# EAGLE design on_protoboard (EAGLE 7.7.0)
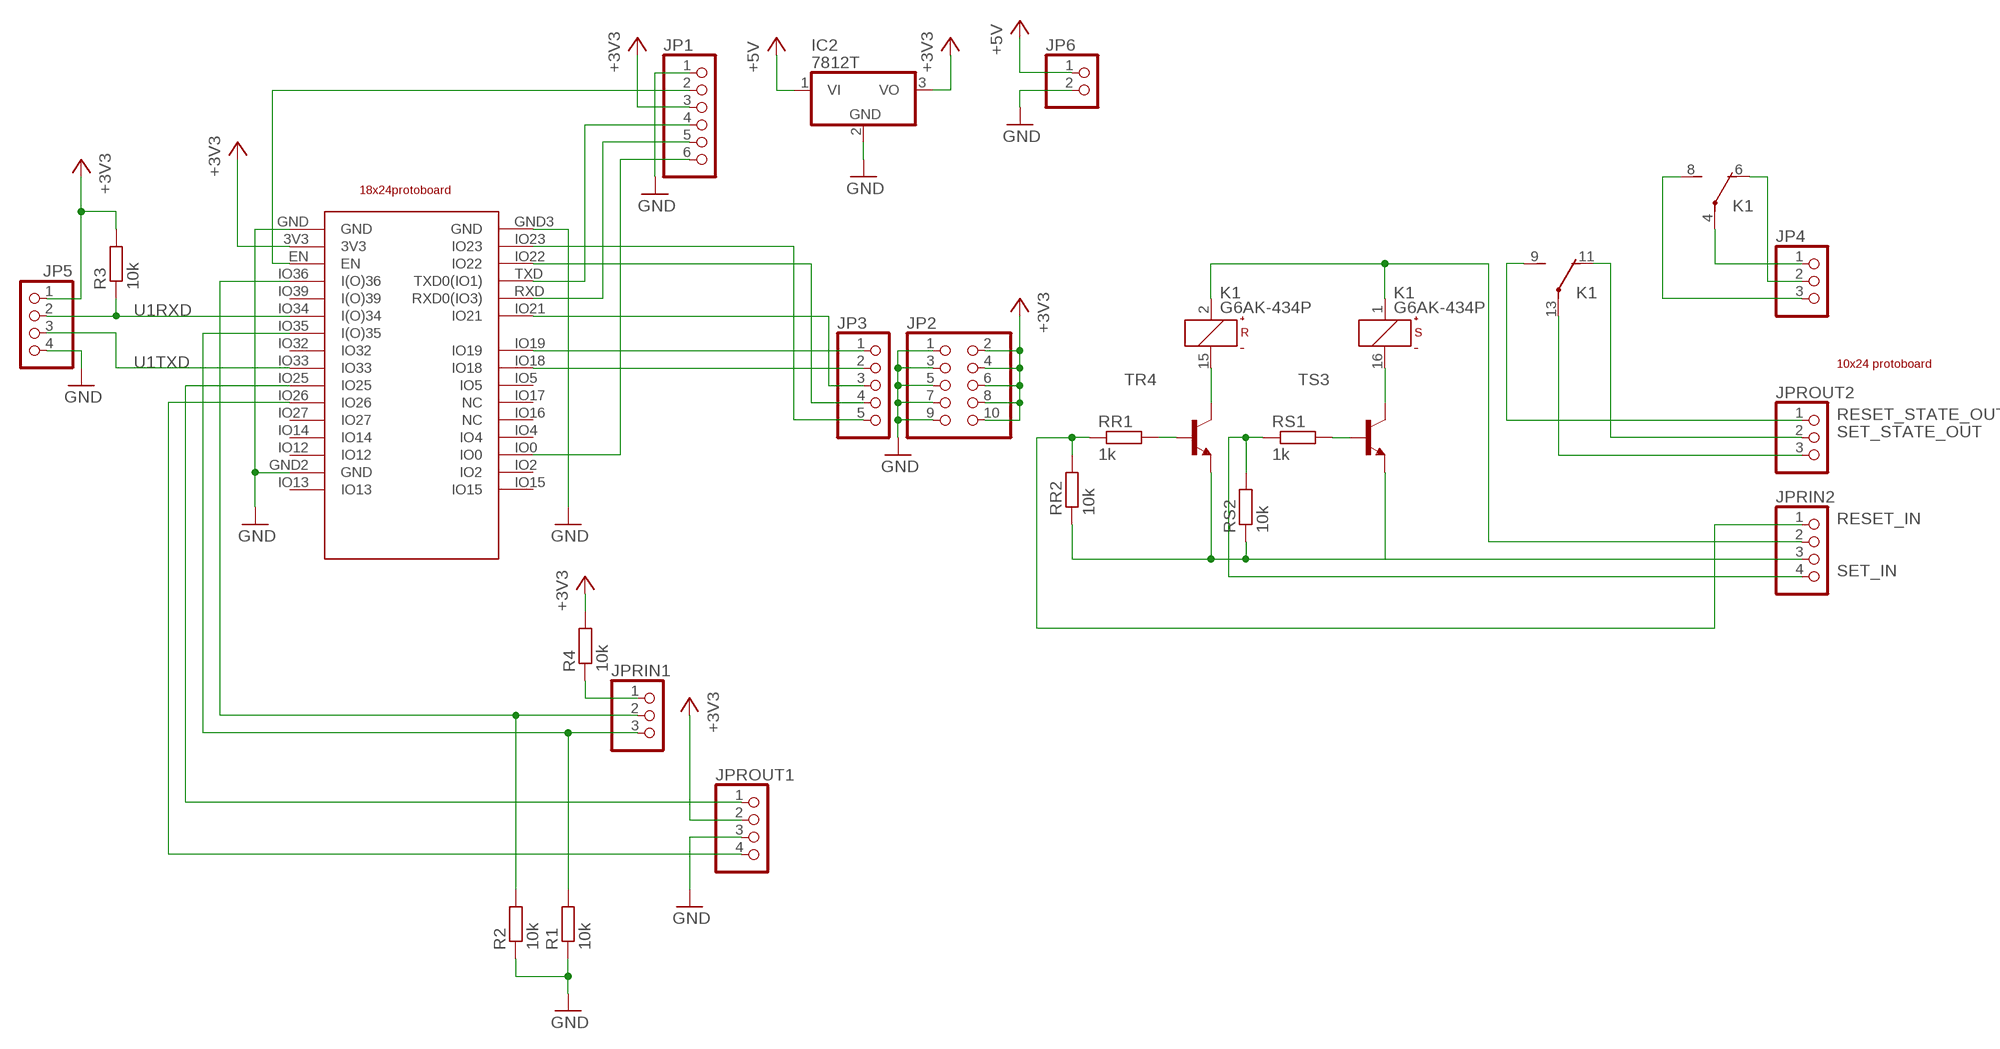
[diagram p0: schematic, sheet 1]

## Parts
ESP-32S-ADAPTER-PCB1  ESP-32S-ADAPTER-BREAKOUT  [ESP-32S-ADAPTER-PCB]
IC2  7812T  [TO220H]
JP1  PINHD-1X6/90  [1X06/90]
JP2  PINHD-2X5  [2X05]
JP3  PINHD-1X5  [1X05]
JP4  PINHD-1X3  [1X03]
JP5  PINHD-1X4  [1X04]
JP6  PINHD-1X2  [1X02]
JPRIN1  PINHD-1X3  [1X03]
JPRIN2  PINHD-1X4  [1X04]
JPROUT1  PINHD-1X4  [1X04]
JPROUT2  PINHD-1X3  [1X03]
K1  G6AK-434P  [G6AK-434P]
R1  10k  R-EU_R0603  [R0603]
R2  10k  R-EU_R0603  [R0603]
R3  10k  R-EU_R0603  [R0603]
R4  10k  R-EU_R0603  [R0603]
RR1  1k  R-EU_R0603  [R0603]
RR2  10k  R-EU_R0603  [R0603]
RS1  1k  R-EU_R0603  [R0603]
RS2  10k  R-EU_R0603  [R0603]
TR4  -NPN-TO92-EBC  [TO92-EBC]
TS3  -NPN-TO92-EBC  [TO92-EBC]
U$1  18X24  [PROTOBOARD_18X24_HOLE]
U$2  10X24  [PROTOBOARD_10X24_HOLE]

## Nets
+3V3: ESP-32S-ADAPTER-PCB1.3V3 IC2.3(VO) JP1.3 JP2.2 JP2.4 JP2.6 JP2.8 JP2.10 JP5.1 JPROUT1.2 R3.2 R4.2
+5V: IC2.1(VI) JP6.1
GND: ESP-32S-ADAPTER-PCB1.GND ESP-32S-ADAPTER-PCB1.GND2(GND) ESP-32S-ADAPTER-PCB1.GND3(GND) IC2.2(GND) JP1.1 JP2.1 JP2.3 JP2.5 JP2.7 JP2.9 JP5.4 JP6.2 JPROUT1.3 R1.1 R2.1
N$1: ESP-32S-ADAPTER-PCB1.EN JP1.2
N$2: JPRIN2.2 K1.1(-S:+) K1.2(-R:+)
N$3: ESP-32S-ADAPTER-PCB1.TXD(TXD0(IO1)) JP1.4
N$4: ESP-32S-ADAPTER-PCB1.RXD(RXD0(IO3)) JP1.5
N$5: K1.15(-R:-) TR4.C
N$6: ESP-32S-ADAPTER-PCB1.IO0 JP1.6
N$7: K1.16(-S:-) TS3.C
N$8: RS1.2 TS3.B
N$9: JPRIN2.3 RR2.1 RS2.1 TR4.E TS3.E
N$10: JPROUT2.3 K1.13(-2:P)
N$11: RR1.2 TR4.B
N$12: ESP-32S-ADAPTER-PCB1.IO19 JP3.1
N$13: ESP-32S-ADAPTER-PCB1.IO18 JP3.2
N$14: ESP-32S-ADAPTER-PCB1.IO21 JP3.3
N$15: JP4.1 K1.4(-1:P)
N$16: JP4.3 K1.8(-1:S)
N$17: ESP-32S-ADAPTER-PCB1.IO22 JP3.4
N$18: ESP-32S-ADAPTER-PCB1.IO35(I(O)35) JPRIN1.3 R1.2
N$19: JP4.2 K1.6(-1:O)
N$20: ESP-32S-ADAPTER-PCB1.IO36(I(O)36) JPRIN1.2 R2.2
N$21: ESP-32S-ADAPTER-PCB1.IO23 JP3.5
N$22: JPRIN1.1 R4.1
N$23: ESP-32S-ADAPTER-PCB1.IO25 JPROUT1.1
N$24: ESP-32S-ADAPTER-PCB1.IO26 JPROUT1.4
RESET_IN: JPRIN2.1 RR1.1 RR2.2
RESET_STATE_OUT: JPROUT2.1 K1.9(-2:S)
SET_IN: JPRIN2.4 RS1.1 RS2.2
SET_STATE_OUT: JPROUT2.2 K1.11(-2:O)
U1RXD: ESP-32S-ADAPTER-PCB1.IO34(I(O)34) JP5.2 R3.1
U1TXD: ESP-32S-ADAPTER-PCB1.IO33 JP5.3
Unconnected: ESP-32S-ADAPTER-PCB1.IO2 ESP-32S-ADAPTER-PCB1.IO4 ESP-32S-ADAPTER-PCB1.IO5 ESP-32S-ADAPTER-PCB1.IO12 ESP-32S-ADAPTER-PCB1.IO13 ESP-32S-ADAPTER-PCB1.IO14 ESP-32S-ADAPTER-PCB1.IO15 ESP-32S-ADAPTER-PCB1.IO16(NC) ESP-32S-ADAPTER-PCB1.IO17(NC) ESP-32S-ADAPTER-PCB1.IO27 ESP-32S-ADAPTER-PCB1.IO32 ESP-32S-ADAPTER-PCB1.IO39(I(O)39) K1.3(-4:P) K1.5(-4:O) K1.7(-4:S) K1.10(-3:S) K1.12(-3:O) K1.14(-3:P)

## Library data of the parts
ESP-32S-ADAPTER-PCB1 = ESP-32s-adapter-breakout:ESP-32S-ADAPTER-BREAKOUT
IC2 = linear:78*: Positive VOLTAGE REGULATOR Source: http://cache.national.com/ds/LM/LM78L05.pdf http://www.fairchildsemi.com/ds/LM/LM7805.pdf
JP1 = pinhead:PINHD-1X6: PIN HEADER
JP2 = pinhead:PINHD-2X5: PIN HEADER
JP3 = pinhead:PINHD-1X5: PIN HEADER
JP4 JPRIN1 JPROUT2 = pinhead:PINHD-1X3: PIN HEADER
JP5 JPRIN2 JPROUT1 = pinhead:PINHD-1X4: PIN HEADER
JP6 = pinhead:PINHD-1X2: PIN HEADER
K1 = relay:G6AK-434P: RELAY 4 x switch, dual coil latching, 0.3 A/125 V AC, 1 A/30 V DC, Omron; OC_FARNELL: unknown; OC_NEWARK: unknown
R1-R4 RR1 RR2 RS1 RS2 = rcl:R-EU_: RESISTOR, European symbol
TR4 TS3 = transistor:*-NPN-: NPN Transistror BF959 corrected 2008.03.06
U$1 = Protoboards:18X24
U$2 = Protoboards:10X24

## Board
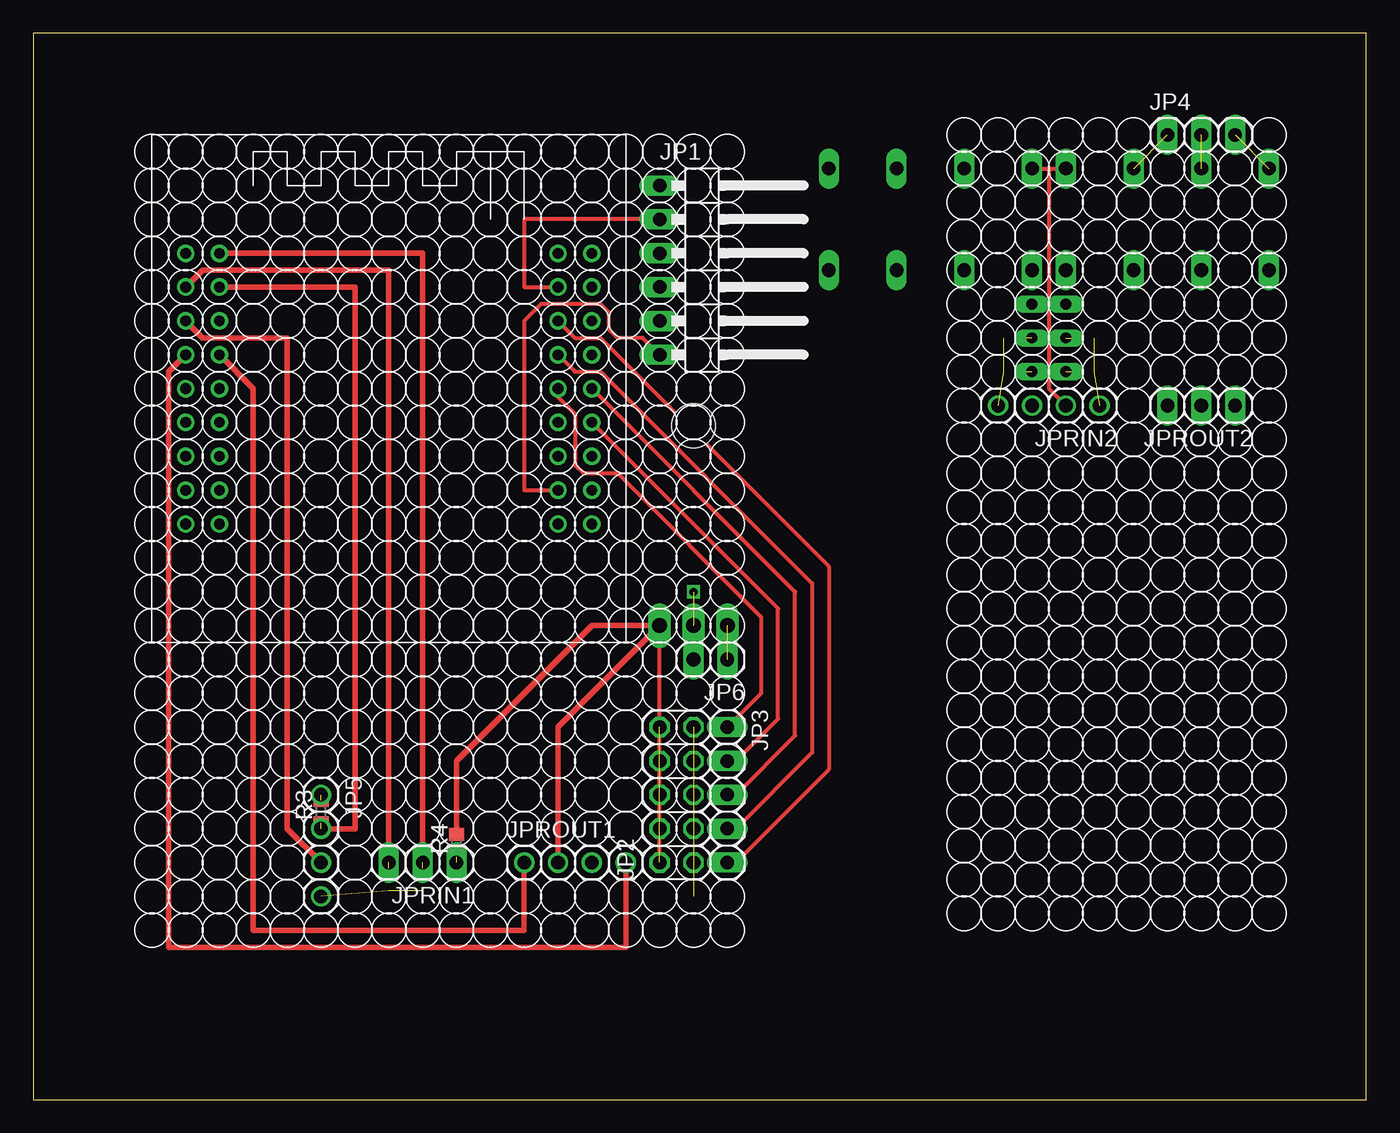
[diagram p1: board, top side]
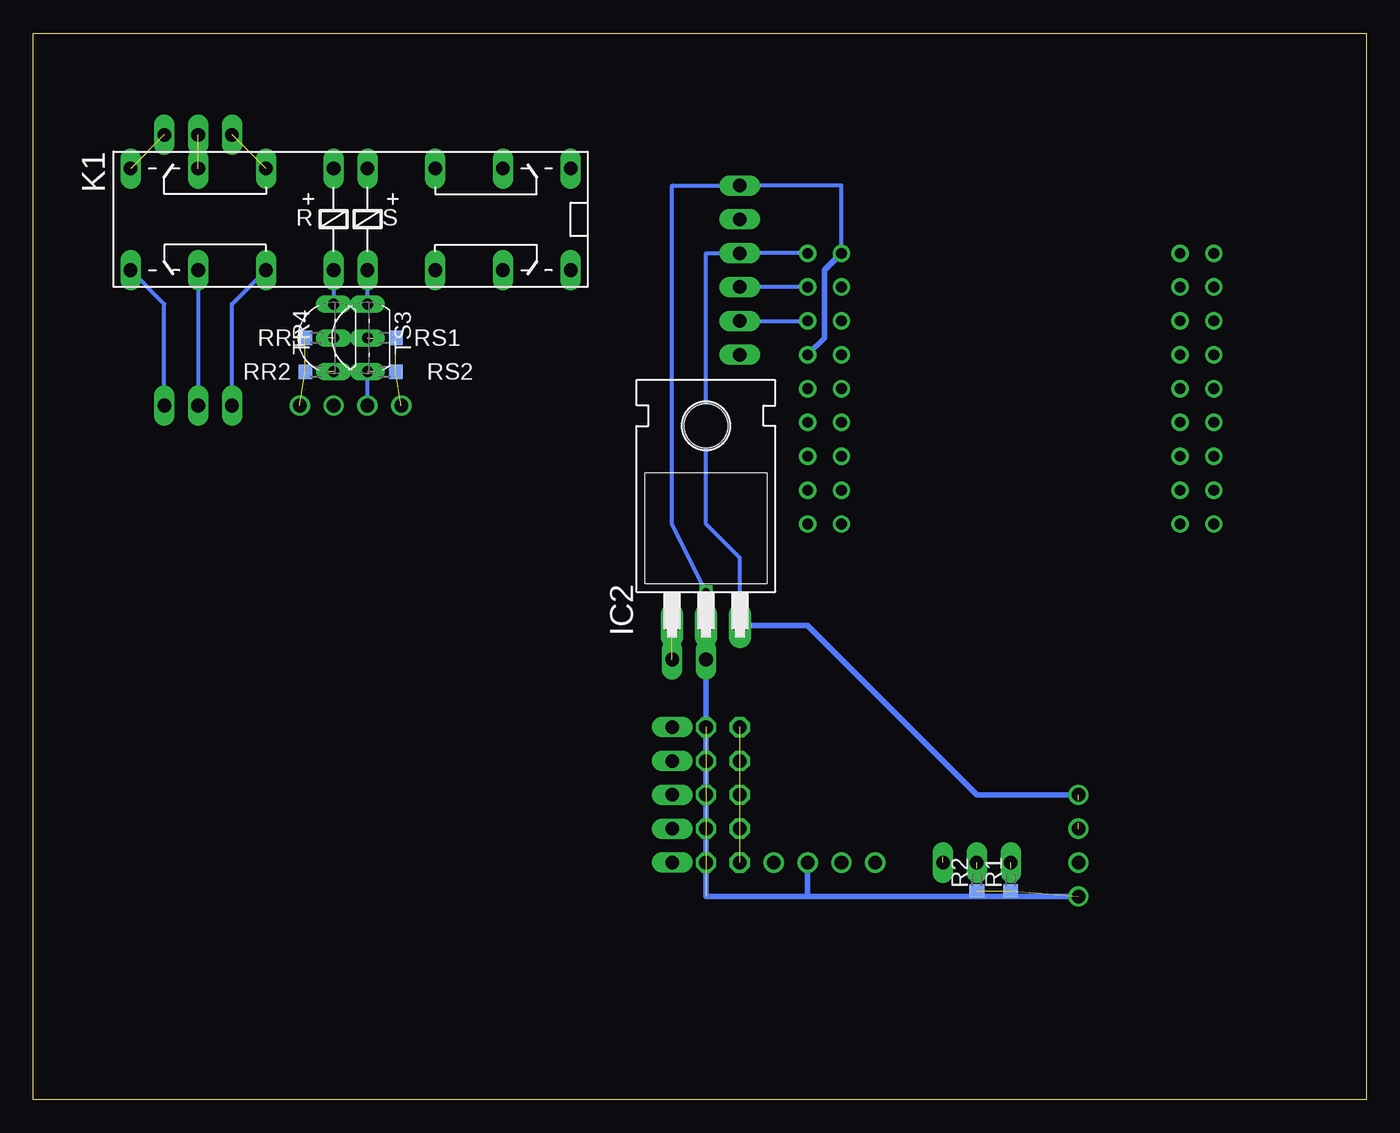
[diagram p2: board, bottom side, seen from below]

Size 100 x 80 mm. Coordinates in mm from the lower left corner, seen from the top.
Outline: 0,0 100,0 100,80 0,80 0,0
Copper layers (1*16): Top 0.035mm / dielectric 1.5mm / Bottom 0.035mm
Design rules "default": minimum track width 10mil, minimum drill 24mil, track to track 8mil, track to pad 8mil, pad to pad 8mil, via to via 8mil, smd to smd 8mil, copper to edge 40mil, drill to drill 8mil, minimum pad ring 10mil, minimum via ring 8mil, stop-mask expansion 4mil, vias tented up to drill 0mil, thermal gap 10mil

### Footprints (pad centres in the part's own frame; a part is rotated, then mirrored left to right if it is on the bottom)
ESP-32S-ADAPTER-PCB = drill 0.8: 3V3 15.24,10.16; CLK -15.24,-7.62; CMD -12.7,-7.62; EN 12.7,7.62; GND 12.7,10.16; GND2 15.24,2.54; GND3 12.7,10.16; IO0 12.7,-7.62; IO2 15.24,-10.16; IO4 15.24,-7.62; IO5 12.7,-2.54; IO12 -12.7,-2.54; IO13 -15.24,-2.54; IO14 -15.24,0; IO15 12.7,-10.16; IO16 12.7,-5.08; IO17 15.24,-5.08; IO18 15.24,-2.54; IO19 12.7,0; IO21 15.24,0; IO22 12.7,2.54; IO23 12.7,5.08; IO25 -12.7,2.54; IO26 -15.24,2.54; IO27 -12.7,0; IO32 -12.7,5.08; IO33 -15.24,5.08; IO34 -12.7,7.62; IO35 -15.24,7.62; IO36 -12.7,10.16; IO39 -15.24,10.16; RXD 15.24,5.08; SD2 -12.7,-5.08; SD3 -15.24,-5.08; SDI -15.24,-10.16; SDO -12.7,-10.16; TXD 15.24,7.62
TO220H = drill 1.118 long: 1 -2.54,-10.16; 2 0,-10.16; 3 2.54,-10.16 | hole 3.302: 0,4.826
1X06/90 = drill 1.016 long: 1 -6.35,-3.81; 2 -3.81,-3.81; 3 -1.27,-3.81; 4 1.27,-3.81; 5 3.81,-3.81; 6 6.35,-3.81
2X05 = drill 1.016 octagon: 1 -5.08,-1.27; 2 -5.08,1.27; 3 -2.54,-1.27; 4 -2.54,1.27; 5 0,-1.27; 6 0,1.27; 7 2.54,-1.27; 8 2.54,1.27; 9 5.08,-1.27; 10 5.08,1.27
1X05 = drill 1.016 long: 1 -5.08,0; 2 -2.54,0; 3 0,0; 4 2.54,0; 5 5.08,0
1X03 = drill 1.016 long: 1 -2.54,0; 2 0,0; 3 2.54,0
1X04 = drill 1.016: 1 -3.81,0; 2 -1.27,0; 3 1.27,0; 4 3.81,0
1X02 = drill 1.016 long: 1 -1.27,0; 2 1.27,0
G6AK-434P = drill 1.016 long: 1 -1.27,-3.81; 2 1.27,-3.81; 3 -6.35,-3.81; 4 6.35,-3.81; 5 -11.43,-3.81; 6 11.43,-3.81; 7 -16.51,-3.81; 8 16.51,-3.81; 9 16.51,3.81; 10 -16.51,3.81; 11 11.43,3.81; 12 -11.43,3.81; 13 6.35,3.81; 14 -6.35,3.81; 15 1.27,3.81; 16 -1.27,3.81
R0603 = smd 1 x 1.1: 1 -0.85,0; 2 0.85,0
TO92-EBC = drill 0.813 long: B 0,-1.27; C 2.54,-1.27; E -2.54,-1.27

### Placement (x,y rotation side)
ESP-32S-ADAPTER-PCB1  26.67,53.34 0 top
IC2  49.53,45.72 0 bottom
JP1  50.8,62.23 270 top
JP2  48.26,22.86 90 top
JP3  52.07,22.86 270 top
JP4  87.63,72.39 0 top
JP5  21.59,19.05 270 top
JP6  50.8,33.02 180 top
JPRIN1  29.21,17.78 180 top
JPRIN2  76.2,52.07 180 top
JPROUT1  40.64,17.78 0 top
JPROUT2  87.63,52.07 180 top
K1  76.2,66.04 180 bottom
R1  26.67,16.51 90 bottom
R2  29.21,16.51 90 bottom
R3  21.59,21.59 90 top
R4  31.75,19.05 90 top
RR1  78.74,57.15 0 bottom
RR2  78.74,54.61 180 bottom
RS1  73.66,57.15 180 bottom
RS2  73.66,54.61 0 bottom
TR4  78.74,57.15 90 bottom
TS3  76.2,57.15 90 bottom
U$1  30.48,41.91 0 top
U$2  81.28,45.72 0 top

### Tracks (layer width: path | path; a pad name or v marks a point on that pad's centre or on a via)
+3V3  (5 unrouted)
  Top 0.305: JP2.2 IC2.3
  Top 0.406: R4.2 31.75,25.4 41.91,35.56 IC2.3 39.37,27.94 JPROUT1.2
  Bottom 0.305: ESP-32S-ADAPTER-PCB1.3V3 JP1.3 49.53,63.5 49.53,43.18 46.99,40.64 IC2.3
  Bottom 0.406: IC2.3 41.91,35.56 29.21,22.86 JP5.1
+5V  (1 unrouted)
GND  (via drill 0.6)  (8 unrouted)
  Bottom 0.305: ESP-32S-ADAPTER-PCB1.GND3 39.37,68.58 JP1.1 52.07,68.58 52.07,43.18 v49.53,38.1 JP6.2
  Bottom 0.406: JP5.4 41.91,15.24 | 41.91,15.24 49.53,15.24 JP6.2 | JPROUT1.3 41.91,15.24 | ESP-32S-ADAPTER-PCB1.GND2 40.64,57.15 40.64,62.23 ESP-32S-ADAPTER-PCB1.GND3
N$1
  Top 0.305: JP1.2 36.83,66.04 36.83,60.96 ESP-32S-ADAPTER-PCB1.EN
N$2
  Top 0.305: 76.2,69.85 K1.2 | K1.1 76.2,69.85 | 76.2,69.85 76.2,53.34 JPRIN2.2
N$3
  Bottom 0.305: ESP-32S-ADAPTER-PCB1.TXD JP1.4
N$4
  Bottom 0.305: JP1.5 ESP-32S-ADAPTER-PCB1.RXD
N$5
  Bottom 0.305: K1.15 TR4.C
N$6
  Top 0.305: JP1.6 45.72,57.15 43.81,57.15 43.18,57.78 43.18,59.05 42.55,59.69 38.1,59.69 36.83,58.42 36.83,45.72 ESP-32S-ADAPTER-PCB1.IO0
N$7
  Bottom 0.305: TS3.C K1.16
N$8  (1 unrouted)
N$9  (via drill 0.6)  (2 unrouted)
  Bottom 0.305: TR4.E TS3.E JPRIN2.3
  other vias: 74.93,54.61
N$10
  Bottom 0.305: JPROUT2.3 85.09,59.69 K1.13
N$11  (1 unrouted)
N$12
  Top 0.305: ESP-32S-ADAPTER-PCB1.IO19 39.37,52.7 40.64,51.44 40.64,47.62 41.27,46.99 43.81,46.99 54.61,36.2 54.61,30.48 JP3.1
N$13
  Top 0.305: JP3.2 52.7,25.4 55.88,28.57 55.88,36.83 ESP-32S-ADAPTER-PCB1.IO18
N$14
  Top 0.305: JP3.3 52.7,22.86 57.15,27.3 57.15,38.1 ESP-32S-ADAPTER-PCB1.IO21
N$15  (1 unrouted)
N$16  (1 unrouted)
N$17
  Top 0.305: ESP-32S-ADAPTER-PCB1.IO22 40.64,54.61 42.55,54.61 58.42,38.73 58.42,26.04 52.7,20.32 JP3.4
N$18  (1 unrouted)
  Top 0.406: JPRIN1.3 26.67,62.23 12.7,62.23 ESP-32S-ADAPTER-PCB1.IO35
N$19  (1 unrouted)
N$20  (1 unrouted)
  Top 0.406: JPRIN1.2 29.21,63.5 ESP-32S-ADAPTER-PCB1.IO36
N$21
  Top 0.305: ESP-32S-ADAPTER-PCB1.IO23 40.64,57.15 42.55,57.15 59.69,40.01 59.69,24.77 52.7,17.78 JP3.5
N$22  (1 unrouted)
N$23
  Top 0.406: ESP-32S-ADAPTER-PCB1.IO25 16.51,53.34 16.51,12.7 36.83,12.7 JPROUT1.1
N$24
  Top 0.406: JPROUT1.4 44.45,11.43 10.16,11.43 10.16,54.61 ESP-32S-ADAPTER-PCB1.IO26
RESET_IN  (2 unrouted)
RESET_STATE_OUT
  Bottom 0.305: JPROUT2.1 90.17,59.69 K1.9
SET_IN  (2 unrouted)
SET_STATE_OUT
  Bottom 0.305: K1.11 JPROUT2.2
U1RXD  (1 unrouted)
  Top 0.406: JP5.2 24.13,20.32 24.13,60.96 ESP-32S-ADAPTER-PCB1.IO34
U1TXD
  Top 0.406: JP5.3 19.05,20.32 19.05,57.15 12.7,57.15 ESP-32S-ADAPTER-PCB1.IO33